# Altium project motherboard.PrjPcb
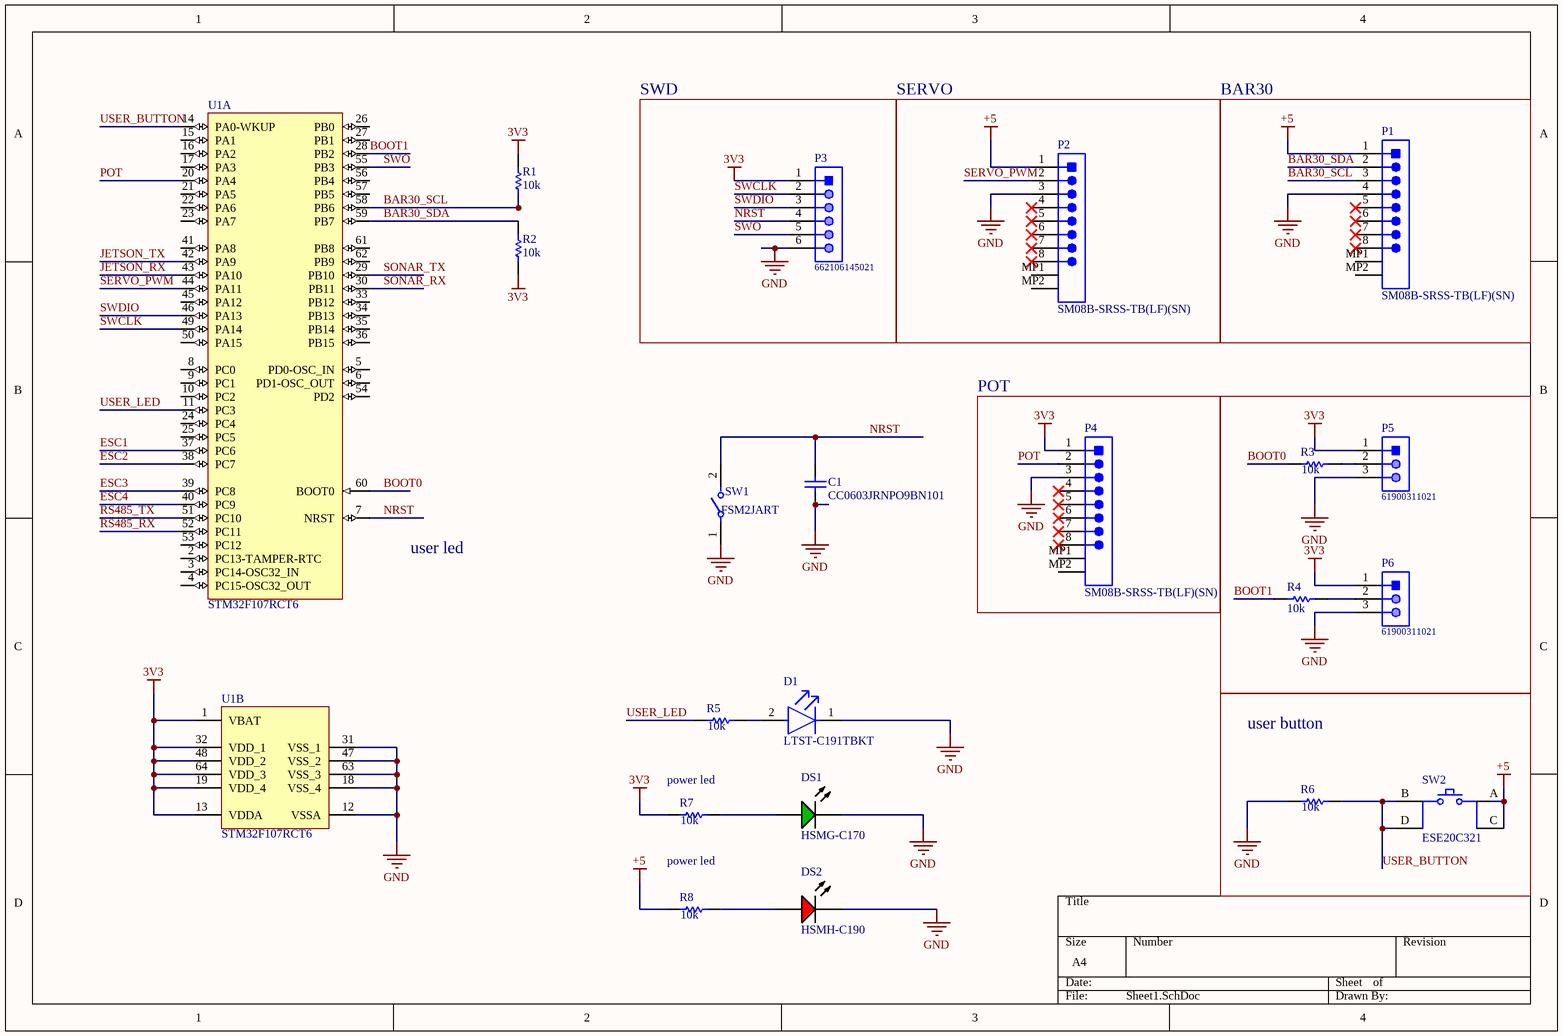
[diagram p0: Sheet1.SchDoc]
2 sheets, 42 parts. Net scope: global (net labels, ports and power ports of the same name join across sheets).
Board files: 2.PcbDoc, pcb1 (2).PcbDoc
Sheets:
  Sheet1.SchDoc
  Sheet2.SchDoc

## Sheet Sheet1.SchDoc
size A4; SheetNumber: 1; SheetTotal: 2

### Parts
C1  CC0603JRNPO9BN101  [CAPC1608X90X40ML10T20]
D1  LTST-C191TBKT  [FP-LTST-C191TBKT-MFG]
DS1  HSMG-C170  [AVAG-HSMX-C170_V]
DS2  HSMH-C190  [AVAG-HSMX-C190_V]
P1  SM08B-SRSS-TB(LF)(SN)  [JST-SM08B-SRSS-TB_V]
P2  SM08B-SRSS-TB(LF)(SN)  [JST-SM08B-SRSS-TB_V]
P3  662106145021  [662106145021]
P4  SM08B-SRSS-TB(LF)(SN)  [JST-SM08B-SRSS-TB_V]
P5  61900311021  [61900311021]
P6  61900311021  [61900311021]
R1  10k  [RESC1609X50X30LL8T20]
R2  10k  [RESC1609X50X30LL8T20]
R3  10k  [RESC1609X50X30LL8T20]
R4  10k  [RESC1609X50X30LL8T20]
R5  10k  [RESC1609X50X30LL8T20]
R6  10k  [RESC1609X50X30LL8T20]
R7  10k  [RESC1609X50X30LL8T20]
R8  10k  [RESC1609X50X30LL8T20]
SW1  FSM2JART  [FP-FSM2JART-MFG]
SW2  ESE20C321  [FP-ESE20C321-MFG]
U1  STM32F107RCT6  [STM-LQFP64_M]  (parts A,B of 2)

### Blocks framed on the sheet
SERVO: P2
BAR30: P1
POT: P4
user button: R6 SW2

### Nets
3V3: P3.1 P4.1 P5.1 P6.1 R1.2 R2.1 R7.1 U1.1(VBAT) U1.13(VDDA) U1.19(VDD_4) U1.32(VDD_1) U1.48(VDD_2) U1.64(VDD_3)
+5: P1.1 P2.1 R8.1 SW2.A SW2.C
GND: C1.1 D1.1(C) DS1.2(K) DS2.2(K) P1.4 P2.3 P3.6 P4.3 P5.3 P6.3 R6.1 SW1.1 U1.12(VSSA) U1.18(VSS_4) U1.31(VSS_1) U1.47(VSS_2) U1.63(VSS_3)
BAR30_SCL: P1.3 R1.1 U1.58(PB6)
BAR30_SDA: P1.2 R2.2 U1.59(PB7)
BOOT0: R3.1 U1.60(BOOT0)
BOOT1: R4.1 U1.28(PB2)
ESC1: U1.37(PC6)
ESC2: U1.38(PC7)
ESC3: U1.39(PC8)
ESC4: U1.40(PC9)
JETSON_RX: U1.43(PA10)
JETSON_TX: U1.42(PA9)
NRST: C1.2 P3.4 SW1.2 U1.7(NRST)
POT: P4.2 U1.20(PA4)
RS485_RX: U1.52(PC11)
RS485_TX: U1.51(PC10)
SERVO_PWM: P2.2 U1.44(PA11)
SONAR_RX: U1.30(PB11)
SONAR_TX: U1.29(PB10)
SWCLK: P3.2 U1.49(PA14)
SWDIO: P3.3 U1.46(PA13)
SWO: P3.5 U1.55(PB3)
USER_BUTTON: R6.2 SW2.B SW2.D U1.14(PA0-WKUP)
USER_LED: R5.1 U1.11(PC3)
NetD1_2: D1.2(A) R5.2
NetDS1_1: DS1.1(A) R7.2
NetDS2_1: DS2.1(A) R8.2
NetP5_2: P5.2 R3.2
NetP6_2: P6.2 R4.2

Not connected (* = marked no-connect by the designer): P1 5* 6* 7* 8* MP1 MP2; P2 4* 5* 6* 7* 8* MP1 MP2; P4 4* 5* 6* 7* 8* MP1 MP2; U1 2(PC13-TAMPER-RTC) 3(PC14-OSC32_IN) 4(PC15-OSC32_OUT) 5(PD0-OSC_IN) 6(PD1-OSC_OUT) 8(PC0) 9(PC1) 10(PC2) 15(PA1) 16(PA2) 17(PA3) 21(PA5) 22(PA6) 23(PA7) 24(PC4) 25(PC5) 26(PB0) 27(PB1) 33(PB12) 34(PB13) 35(PB14) 36(PB15) 41(PA8) 45(PA12) 50(PA15) 53(PC12) 54(PD2) 56(PB4) 57(PB5) 61(PB8) 62(PB9)

### Notes on the sheet
- SWD
- user led
- (near R7) power led
- power led

### Library data of the parts
C1 = CMP-2100-03594-1: Chip Capacitor, 100 pF, +/- 5%, 50 V, -55 to 125 degC, 0603 (1608 Metric), RoHS, Tape and Reel; Manufacturer: Yageo; Capacitance: 100pF; Voltage Rating (DC): 50V; Dielectric: C0G; Temperature Coefficient: 30ppm/degC; Insulation Resistance: 100GR; Datasheet Version: Rev. 14, 07/2016; Manufacturer URL: http://www.yageo.com/; Packaging: TapeandReel; Mount: SurfaceMount; RoHSCompliant: True; Package Reference: 0603; Tolerance: 5%; Max Operating Temperature: 125degC; Case Code (Imperial): 0603; Number of Pins: 2; Width: 0.8mm; Case Code (Metric): 1608; Voltage: 50V; REACH SVHC: Unknown; Package Description: 2-Pin Surface Mount Device, Body 1.6 x 0.8 mm; Composition: Ceramic; Lead Free: LeadFree; Min Operating Temperature: -55degC; Radiation Hardening: No; Depth: 0.8mm; Thickness: 0.035inch; Datasheet URL: http://www.yageo.com/documents/recent/UPY-GP_NP0_16V-to-50V_14.pdf; Termination: SMD/SMT; Package Quantity: 1; Length: 1.6mm; Voltage Rating: 50V; Height: 0.8mm; Case/Package: 0603
D1 = CMP-22017-000008-1: LED BLUE CLEAR CHIP SMD; Lens Color: Colorless; Dominant Wavelength: 475nm; Forward Current: 20mA; Wavelength: 468nm; Viewing Angle: 130°; Power Dissipation: 76mW; Luminous Intensity: 180mcd; Reverse Voltage: 5V; Number of Elements: 1; Lens Style: Diffused; Forward Voltage: 3.8V; Max Power Dissipation: 75mW; Case Code (Metric): 1608; Packaging: Tape and Reel; Case/Package: 0603; Depth: 1.6mm; Mount: Surface Mount; Lead Free: Lead Free; Min Operating Temperature: -20°C; Lens Transparency: Clear; Illumination Color: Blue; Height: 0.55mm; Test Current: 20mA; Case Code (Imperial): 0603; Max Operating Temperature: 80°C; Number of Pins: 2; Length: 0.8mm; Radiation Hardening: No; Package Quantity: 1; Number of LEDs: 1; Width: 0.8mm; Color: Blue
DS1 = CMP-2000-05062-1: Chip LED, Green, 2.2 V, -40 to 85 degC, 2-Pin SMD, Pb-Free, Tape and Reel; Manufacturer: Avago; No. of Pins: 2; Peak Wavelength: 570nm; SVHC: NoSVHC(16-Jun-2014); Dominant Wavelength: 572nm; Forward Current If: 20mA; Viewing Angle: 170deg; Lens Shape: Rectangular; PIV Max: 5V; External Width: 1.25mm; LED Type: Standard; External Depth: 0.8mm; Opto Mounting Orientation: Top; Luminous Intensity: 15mcd; Luminous Intensity Min: 4mcd; Forward Voltage VF Max: 2.6V; External Length / Height: 2mm; Bulb Size: 1.25mmx1.4mm; Light Area Height: 1mm; Voltage Vf Typ: 2.2V; Operating Temperature Max: 85degC; Datasheet Version: Oct-08; MSL: MSL2A-4weeks; Peak Forward Current: 20mA; Package Description: 2-Pin Surface Mount Device, Body 2 x 1.25 mm, Height 0.8 mm; Datasheet URL: https://datasheet.ciiva.com/29280/180495-da-01-en-chip-led-hsmg-c170-gelb-gruen-29280971.pdf; Storage Temperature Min: -40degC; LED Colour: Green; Wavelength Typ: 570nm; Mounting Type: SMD; Forward Current If Max: 20mA; Dominant Wavelength Typ: 572nm; LED Mounting: SMD; Operating Temperature Range: -30degCto+85degC; Operating Temperature Min: -30degC; Manufacturer URL: http://www.avagotech.com/; Packaging: CutTape; Luminous Intensity Typ: 15mcd; Package Reference: HSMX-C170; Storage Temperature Max: 85degC; Opto Case Style: SMD; Forward Voltage: 2.2V
DS2 = CMP-1744-00004-1: LED Uni-Color Red, 65 mW, 20 mA, -40 to 85 degC, 2-Pin SMD, RoHS, Tape and Reel; Connector Type: USB; Gender: Male; Current Rating: 1 A; Length: 7.5 mm; Lead Pitch: 0.65 mm; PackageReference: HSMX-C190; Package Quantity: 2000; Max Operating Temperature: 85 degC; PackageDescription: 2-Pin Surface Mount Device, Body 1.6 x 0.8 mm, Height 0.9 mm; ComponentLink3Description: Package Specification; Mount: Surface Mount; Min Operating Temperature: -30 degC; ComponentLink3URL: http://www.fairchildsemi.com/dwg/MA/MA03D.pdf; ComponentLink1Description: Manufacturer URL; Contact Material: Copper; Pins: 5; Width: 5.6 mm; ComponentLink2Description: Datasheet; RoHSCompliant: true; DatasheetVersion: Mar-12; Height: 2.8 mm; Packaging: Tape and Reel; Contact Plating: Gold; ComponentLink1URL: http://www.avagotech.com/; REACH SVHC: No SVHC; ComponentLink2URL: http://docs.avagotech.com/docs/AV02-0551EN
P1 P2 P4 = CMP-2000-07082-1: Male Header, Pitch 1 mm, 1 x 8 Position, Height 2.95 mm, -25 to 85 degC, RoHS, Tape and Reel; Manufacturer: JST; Style/Orientation: RightAngleHeader/Plug; Pitch: 1mm; No of Positions: 8; Manufacturer URL: http://www.jst.com/home2.html; Mounting Technology: SurfaceMount; Package Description: Male Header, Pitch 1 mm, 1 x 8 Position, Height 2.95 mm; Datasheet URL: http://www.jst-mfg.com/product/pdf/eng/eSR.pdf; Type: ShroudedHeader; Termination: Crimp; Package Reference: SM08B-SRSS-TB; Datasheet Version: 11/2010
P3 = CMP-1502-00486-1: SMT Male Header WR-MPC3, with SMT Solder Tabs, Right Angled, Single Row, pitch 3 mm, 6 pins; Manufacturer: Wurth Elektronik; Pin Number: 6; Working Voltage: 250VAC; Pitch: 3mm; Contact Resistance: 10mOhm; Orientation: RightAngled; Publisher: WurthElektronik; Gender: Male; Mounting Technology: SMT; Datasheet URL: https://katalog.we-online.de/em/datasheet/6621xx145021.pdf; Manufacturer URL: http://www.we-online.de; Package Reference: 662106145021; Operating Temperature: -40to105degC; Part Number: 662106145021; Packaging: TapeandReel
P5 P6 = CMP-1502-00593-1: Male Bottom Locking Header WR-WTB, THT, Right Angled, pitch 2.54 mm, 1 x 3 position; Manufacturer: Wurth Elektronik; Contact Resistance: 20mOhm; Pitch: 2.54mm; Position: 1x3; Working Voltage: 250VAC; Package Reference: 61900311021; Operating Temperature: -40to105degC; Packaging: Bag; Datasheet URL: https://katalog.we-online.de/em/datasheet/6190xx11021.pdf; Publisher: WurthElektronik; Orientation: RightAngled; Gender: Male; Part Number: 61900311021; Manufacturer URL: http://www.we-online.de; Mounting Technology: THT
R1-R8 = CMP-1666-00005-4: Chip Resistor, 10 KOhm, +/- 1%, 100 mW, -55 to 155 degC, 0603 (1608 Metric), RoHS, Tape and Reel; Manufacturer: Vishay Semiconductor; Voltage Rating: 75 V; Max Operating Temperature: 155 degC; PackageDescription: 2-Pin Surface Mount Device, Body 1.575 x 0.85 mm; ComponentLink1Description: Manufacturer URL; RoHSCompliant: true; PackageReference: 0603; REACH SVHC: Unknown; Length: 1.55 mm; DatasheetVersion: 06/2012; Packaging: Tape and Reel; Min Operating Temperature: -55 degC; Mounting Technology: Surface Mount; ComponentLink2URL: https://datasheet.ciiva.com/11809/0900766b80d98afc-11809037.pdf; Height: 0.45 mm; ComponentLink2Description: Datasheet; Package Quantity: 5000; ComponentLink1URL: http://www.vishay.com/
SW1 = CMP-03407-000009-1: SWITCH TACTILE SPST-NO 0.05A 12V; Actuator Length: 0.7mm; Switch Function: Off-Mom; Throw Configuration: SPST; Electrical Life: 100000Cycles; Illumination Type: Non-Illuminated; Contact Resistance: 100mR; Operating Force: 260gf; Actuator Type: Standard; Actuator Material: Resin; Contact Current Rating: 50mA; Type: Switch; Contact Plating: Silver; ELV: Compliant; Lead Free: Lead Free; Max Voltage Rating (DC): 12V; Min Operating Temperature: -35°C; Mount: Through Hole; Series: FSMJRT; Max Operating Temperature: 105°C; RoHS Compliant: Yes; Termination: Solder; REACH SVHC: No SVHC; Contact Material: Copper Alloy; Orientation: Straight; Current Rating: 50mA; Package Quantity: 1000; Voltage Rating (DC): 12V; Packaging: Tape and Reel
SW2 = CMP-05613-000002-1: SWITCH PUSH SPST-NO 0.1A 14V; Contact Current Rating: 100mA; Switch Function: Off-Mom; Actuator Type: Square, Button; Throw Configuration: SPST; Operating Force: 4N; REACH SVHC: No SVHC; Max Operating Temperature: 80°C; Current Rating: 100mA; Packaging: Bulk; Radiation Hardening: No; Mount: Through Hole; Voltage Rating (DC): 14V; Termination: PC Pin; Orientation: Straight; Lead Free: Lead Free; Min Operating Temperature: -30°C; Max Voltage Rating (DC): 14V; Package Quantity: 1200; RoHS Compliant: Yes; Series: ESE20C
U1 = CMP-0237-00079-3: ARM Cortex-M3 32-bit MCU, 256 KB Flash, 64 KB Internal RAM, 51 I/Os, 64-pin LQFP, -40 to 85 degC, Tray; FLASH Size (Prog) (kB): 256; Operating Frequency(F) (Processor speed) (MHz): 72; Supply Voltage(Vcc) min (V): 2; Internal RAM Size (kB): 64; A/D Converter: 2x12-bit (16 Channel); I/Os (High Current): 51; D/A Converter: 2x12-bit (2 Channel); Mounting Technology: Surface Mount; PartNumber: STM32F107RCT6; ComponentLink3URL: http://www.st.com/st-web-ui/static/active/en/resource/technical/document/datasheet/DM00037051.pdf; Packing: Tray; ComponentLink1URL: http://www.st.com/web/en/home.html; Core: ARM Cortex-M3; ComponentLink1Description: Manufacturer URL; ComponentLink2URL: http://www.st.com/st-web-ui/static/active/en/resource/technical/document/datasheet/CD00220364.pdf; DatasheetVersion: Rev. 6; PackageDescription: 64-Pin Low Profile Quad Flat Package, 10 x 10 mm Body, 0.5 mm Pitch; PackageVersion: Rev. 4, 06/2013; ComponentLink2Description: Datasheet; ComponentLink3Description: Package Specification; PackageReference: LQFP64

## Sheet Sheet2.SchDoc
size A4; SheetNumber: 2; SheetTotal: 2
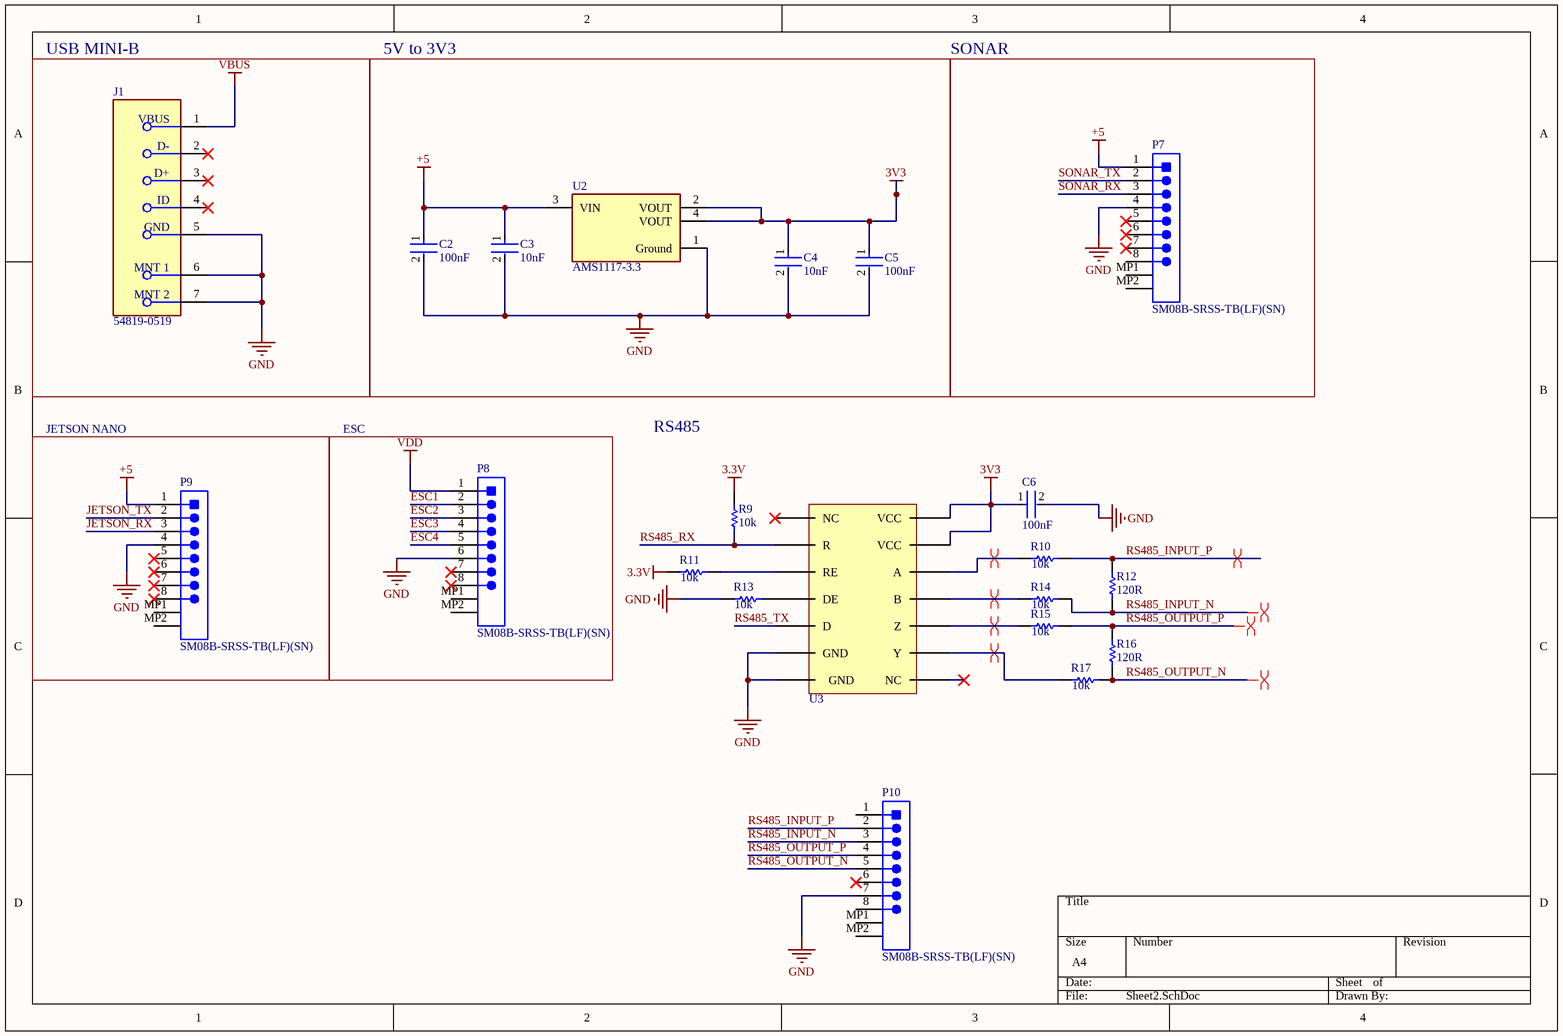
[diagram p1: Sheet2.SchDoc]

### Parts
C2  100nF  [FP-C0402-BB-MFG]
C3  10nF  [FP-C0402-BB-MFG]
C4  10nF  [FP-C0402-BB-MFG]
C5  100nF  [FP-C0402-BB-MFG]
C6  100nF  [FP-C0402-BB-MFG]
J1  54819-0519  [FP-54819-0519-MFG]
P7  SM08B-SRSS-TB(LF)(SN)  [JST-SM08B-SRSS-TB_V]
P8  SM08B-SRSS-TB(LF)(SN)  [JST-SM08B-SRSS-TB_V]
P9  SM08B-SRSS-TB(LF)(SN)  [JST-SM08B-SRSS-TB_V]
P10  SM08B-SRSS-TB(LF)(SN)  [JST-SM08B-SRSS-TB_V]
R9  10k  [RESC1609X50X30LL8T20]
R10  10k  [RESC1609X50X30LL8T20]
R11  10k  [RESC1609X50X30LL8T20]
R12  120R  [RESC1609X50X30LL8T20]
R13  10k  [RESC1609X50X30LL8T20]
R14  10k  [RESC1609X50X30LL8T20]
R15  10k  [RESC1609X50X30LL8T20]
R16  120R  [RESC1609X50X30LL8T20]
R17  10k  [RESC1609X50X30LL8T20]
U2  AMS1117-3.3  [FP-AMS1117-IPC_C]
U3  SN65HVD1473D  [SOIC127P600X175-14N]  (value not drawn)

### Blocks framed on the sheet
USB MINI-B: J1
5V to 3V3: C2-C5 U2
SONAR: P7
JETSON NANO: P9
ESC: P8

### Nets
3.3V: R9.2 R11.1
3V3: C4.1 C5.1 C6.1 U2.2(VOUT) U2.4(VOUT) U3.16(VCC) U3.22(VCC)
+5: C2.1 C3.1 P7.1 P9.1 U2.3(VIN)
GND: C2.2 C3.2 C4.2 C5.2 C6.2 J1.5(GND) J1.6(MNT_1) J1.7(MNT_2) P7.4 P8.6 P9.4 P10.7 R13.1 U2.1(Ground) U3.11(GND) U3.12(GND)
VBUS: J1.1(VBUS)
VDD: P8.1
ESC1: P8.2
ESC2: P8.3
ESC3: P8.4
ESC4: P8.5
JETSON_RX: P9.3
JETSON_TX: P9.2
RS485_INPUT_N: P10.3 R12.1 R14.2
RS485_INPUT_P: P10.2 R10.2 R12.2
RS485_OUTPUT_N: P10.5 R16.1 R17.2
RS485_OUTPUT_P: P10.4 R15.2 R16.2
RS485_RX: R9.1 U3.R
RS485_TX: U3.13(D)
SONAR_RX: P7.3
SONAR_TX: P7.2
NetR10_1: R10.1 U3.21(A)
NetR11_2: R11.2 U3.15(RE)
NetR13_2: R13.2 U3.14(DE)
NetR14_1: R14.1 U3.20(B)
NetR15_1: R15.1 U3.19(Z)
NetR17_1: R17.1 U3.18(Y)

Not connected (* = marked no-connect by the designer): J1 2(D-)* 3(D+)* 4(ID)*; P7 5* 6* 7* 8 MP1 MP2; P8 7* 8* MP1 MP2; P9 5* 6* 7* 8* MP1 MP2; P10 1 6* 8 MP1 MP2; U3 9(NC)* 17(NC)*

### Layout directives
differential pair; differential pair class diff100: NetR10_1, NetR14_1
differential pair; differential pair class diff101: NetR15_1, NetR17_1
differential pair; differential pair class diff103: RS485_OUTPUT_N, RS485_OUTPUT_P
differential pair; differential pair class diff102: RS485_INPUT_N, RS485_INPUT_P

### Notes on the sheet
- RS485

### Library data of the parts
C2-C6 = CMP-2008-02046-2: CAP CER 0.1UF 10V X5R 0402; Manufacturer: Kemet; Manufacturer Part Number: C0402C104K8PACTU; Material: Ceramic; Capacitance: 0.10 μF; Temperature Coefficient: 15%; Tolerance: 0.1; Value: 0.10 μF; Package: C0402-BB; Temperature: -55°C to +125°C; ComponentLink2Description: Datasheet; Temperature Characteristic: X5R; Device Class L1: Passive Components; Height: 0.55mm; Lead Free: Yes; ComponentLink2URL: https://content.kemet.com/datasheets/KEM_C1002_X7R_SMD.pdf; Device Class L2: Capacitors; Temperature Range Low: -55°C; Temperature Range High: +125°C; RoHS: TRUE; Octopart: https://octopart.com/c0402c104k8pactu-kemet-140039; Automotive: No; Mouser Description: Capacitor 100 nF 10 VDC 0402; Category: Cap; Voltage Rating: 10 V; Digikey Description: CAP CER 0.1UF 10V X5R 0402; Ipc Land Pattern Name: CAPC10050X50; Device Class L3: Ceramic Capacitors
J1 = CMP-04767-000009-1: CONN RCPT USB2.0 MINI B 5P R/A; Number of Circuits: 5; Max Current Rating: 1A; Pitch: 0.8mm; Contact Resistance: 50mR; Data Rate: 480Mbps; Gender: Receptacle; Number of Ports: 1; Connector Type: USB; Working Voltage: 30V; Insulation Resistance: 100MR; Number of Rows: 1; Series: 54819; USB Standard: USB 2.0; Contact Plating: Gold; Min Operating Temperature: 0°C; Radiation Hardening: No; Current Rating: 1A; Number of Terminals/Pins: 5; Number of Positions: 5; Packaging: Tray; Termination: Solder; Orientation: Right Angle; Flammability Rating: UL94 V-0; Package Quantity: 3600; Number of Contacts: 5; Lead Free: Lead Free; Max Operating Temperature: 50°C; Color: Black; Housing Color: Black; Contact Material: Copper Alloy; Width: 6.9mm; Length: 7.7mm; Housing Material: Polyamide; Features: Shielded; Mount: Through Hole; Voltage Rating: 30V; Depth: 9mm; Voltage Rating (DC): 30V
P7-P10 = CMP-2000-07082-1: as P1 on sheet Sheet1; Manufacturer URL: http://www.jst.com/home2.html; Mounting Technology: SurfaceMount; Package Description: Male Header, Pitch 1 mm, 1 x 8 Position, Height 2.95 mm; Datasheet URL: http://www.jst-mfg.com/product/pdf/eng/eSR.pdf; Type: ShroudedHeader; Termination: Crimp; Package Reference: SM08B-SRSS-TB; Datasheet Version: 11/2010
R9-R17 = CMP-1666-00005-4: as R1 on sheet Sheet1; Max Operating Temperature: 155 degC; PackageDescription: 2-Pin Surface Mount Device, Body 1.575 x 0.85 mm; ComponentLink1Description: Manufacturer URL; RoHSCompliant: true; PackageReference: 0603; REACH SVHC: Unknown; Length: 1.55 mm; DatasheetVersion: 06/2012; Packaging: Tape and Reel; Min Operating Temperature: -55 degC; Mounting Technology: Surface Mount; ComponentLink2URL: https://datasheet.ciiva.com/11809/0900766b80d98afc-11809037.pdf; Height: 0.45 mm; ComponentLink2Description: Datasheet; Package Quantity: 5000; ComponentLink1URL: http://www.vishay.com/
U2 = CMP-209535-000001-1: LDO Voltage Regulators 1A, 3.3V; Manufacturer: Advanced Monolithic Systems; Dropout Voltage: 1.1V; Output Type: Fixed; Nominal Supply Current: 5mA; Max Power Dissipation: 1.2W; Max Supply Voltage: 15V; Number Of Outputs: 1; Standoff Height: 0.64mm; Max Junction Temp: +125°C; Height: 1.8mm; Package: AMS1117; Device Class L2: Power Management ICs; ComponentLink2Description: Datasheet; ComponentLink2URL: http://www.advanced-monolithic.com/pdf/ds1117.pdf; Category: IC; RoHS: TRUE; Automotive: No; Device Class L1: Integrated Circuits (ICs); Output Current: 1A; Device Class L3: Voltage Regulators - Linear; Temperature: -40°C to +125°C; Output Voltage: 3.3V; Manufacturer Part Number: AMS1117-3.3; Temperature Range Low: -40°C; Octopart: https://octopart.com/ams1117-3.3-advanced+monolithic+systems-25899300; Lead Free: Yes; Ipc Land Pattern Name: SOT229P700X180-4; Temperature Range High: +125°C

## Nets that join several sheets
3V3: Sheet1 (13 pins), Sheet2 (7 pins)
+5: Sheet1 (5 pins), Sheet2 (5 pins)
GND: Sheet1 (17 pins), Sheet2 (16 pins)
ESC1: Sheet1 (U1.37), Sheet2 (P8.2)
ESC2: Sheet1 (U1.38), Sheet2 (P8.3)
ESC3: Sheet1 (U1.39), Sheet2 (P8.4)
ESC4: Sheet1 (U1.40), Sheet2 (P8.5)
JETSON_RX: Sheet1 (U1.43), Sheet2 (P9.3)
JETSON_TX: Sheet1 (U1.42), Sheet2 (P9.2)
RS485_RX: Sheet1 (U1.52), Sheet2 (R9.1 U3.R)
RS485_TX: Sheet1 (U1.51), Sheet2 (U3.13)
SONAR_RX: Sheet1 (U1.30), Sheet2 (P7.3)
SONAR_TX: Sheet1 (U1.29), Sheet2 (P7.2)